# Altium schematic sheet LIS331DLTR - MEMS Motion Sensor - Accelerometer (I2C).SchDoc
size A4
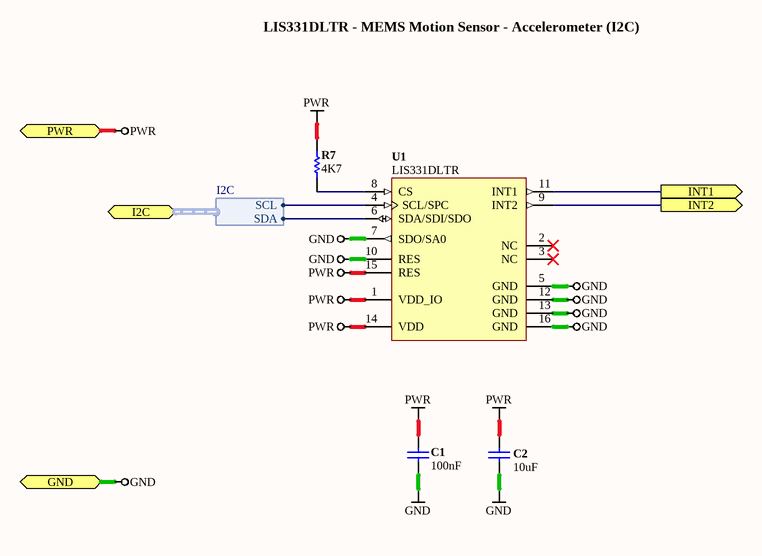
[diagram p0: LIS331DLTR - MEMS Motion Sensor - Accelerometer (I2C).SchDoc]

## Parts
C1  value 100nF  [CAPC0402(1005)60_L]  (hidden comment: CAP 100nF 10V 0402(1005))
C2  value 10uF  [CAPC0603(1608)100_L]  (hidden comment: CAP 10uF 10V 0603(1608))
R7  4K7  [RESC0402(1005)40_L]
U1  LIS331DLTR  [LGA16-3X3X1_L]

## Ports
GND, I2C (harness I2C), INT1 (out), INT2 (out), PWR

## Harnesses
I2C: SDA, SCL

## Nets
GND: C1.2 C2.2 U1.5(GND) U1.7(SDO/SA0) U1.10(RES) U1.12(GND) U1.13(GND) U1.16(GND) ; port GND
PWR: C1.1 C2.1 R7.2 U1.1(VDD_IO) U1.14(VDD) U1.15(RES) ; port PWR
INT1: U1.11(INT1) ; port INT1
INT2: U1.9(INT2) ; port INT2
NetR7_1: R7.1 U1.8(CS)
NetU1_4: U1.4(SCL/SPC) ; port I2C.SCL
NetU1_6: U1.6(SDA/SDI/SDO) ; port I2C.SDA

Not connected (* = marked no-connect by the designer): U1 2(NC)* 3(NC)*

## Notes on the sheet
- LIS331DLTR - MEMS Motion Sensor - Accelerometer (I2C)

## Library data of the parts
C1 = CMP-1034-02065-1: CAP 100nF 10V ¡À10% 0402 (1005 Metric) Thickness 0.6mm SMD; Case-EIA: 0402; Case-Metric: 1005; Max Thickness: 0.6 mm; Tolerance: ¡À10%; Rated Voltage: 10 V; Technology: SMT
C2 = CMP-1035-02799-1: CAP 10uF 10V ¡À10% 0603 (1608 Metric) Thickness 1mm SMD; Case-Metric: 1608; Case-EIA: 0603; Max Thickness: 1 mm; Technology: SMT; Tolerance: ¡À10%; Rated Voltage: 10 V
R7 = 0402 (1005 Metric) 1/16 W 4K7 1 Thick Film Chip Resistor: Case-EIA: 0402; Case-Metric: 1005; Temp Coefficient ppm/°C: ±100; Tolerance %: 1%; Value (Ohms): 4700; Power: 1/16 W; Value: 4K7; Technology: SMT
U1 = CMP-0234-00061-2: MEMS motion sensor 3-axis - ¡À 2g/¡À 8g smart digital output nano accelerometer, -40 to +85¡ãC, LGA-16 (3x3x1), Tape and Reel; Manufacturer: STMicroelectronics; ComponentLink3URL: http://www.st.com/internet/analog/product/191236.jsp; PackageVersion: 2008; ComponentLink2Description: LIS331DL Datasheet; ComponentLink1Description: Manufacturer URL; ComponentLink2URL: http://www.st.com/internet/com/TECHNICAL_RESOURCES/TECHNICAL_LITERATURE/DATASHEET/CD00172345.pdf; RevisionNote: PCB layout corrected.; PackageDescription: 16-Pin Land Grid Array, 3 x 3 x 1 mm Body, 0.5 mm Pitch; DatasheetVersion: rev3, Apr-2008; ComponentLink3Description: LIS331DL Web Page; PackageReference: LGA16-3X3X1; ComponentLink1URL: http://www.st.com/